# EAGLE design l6219-dev (EAGLE 5.12)
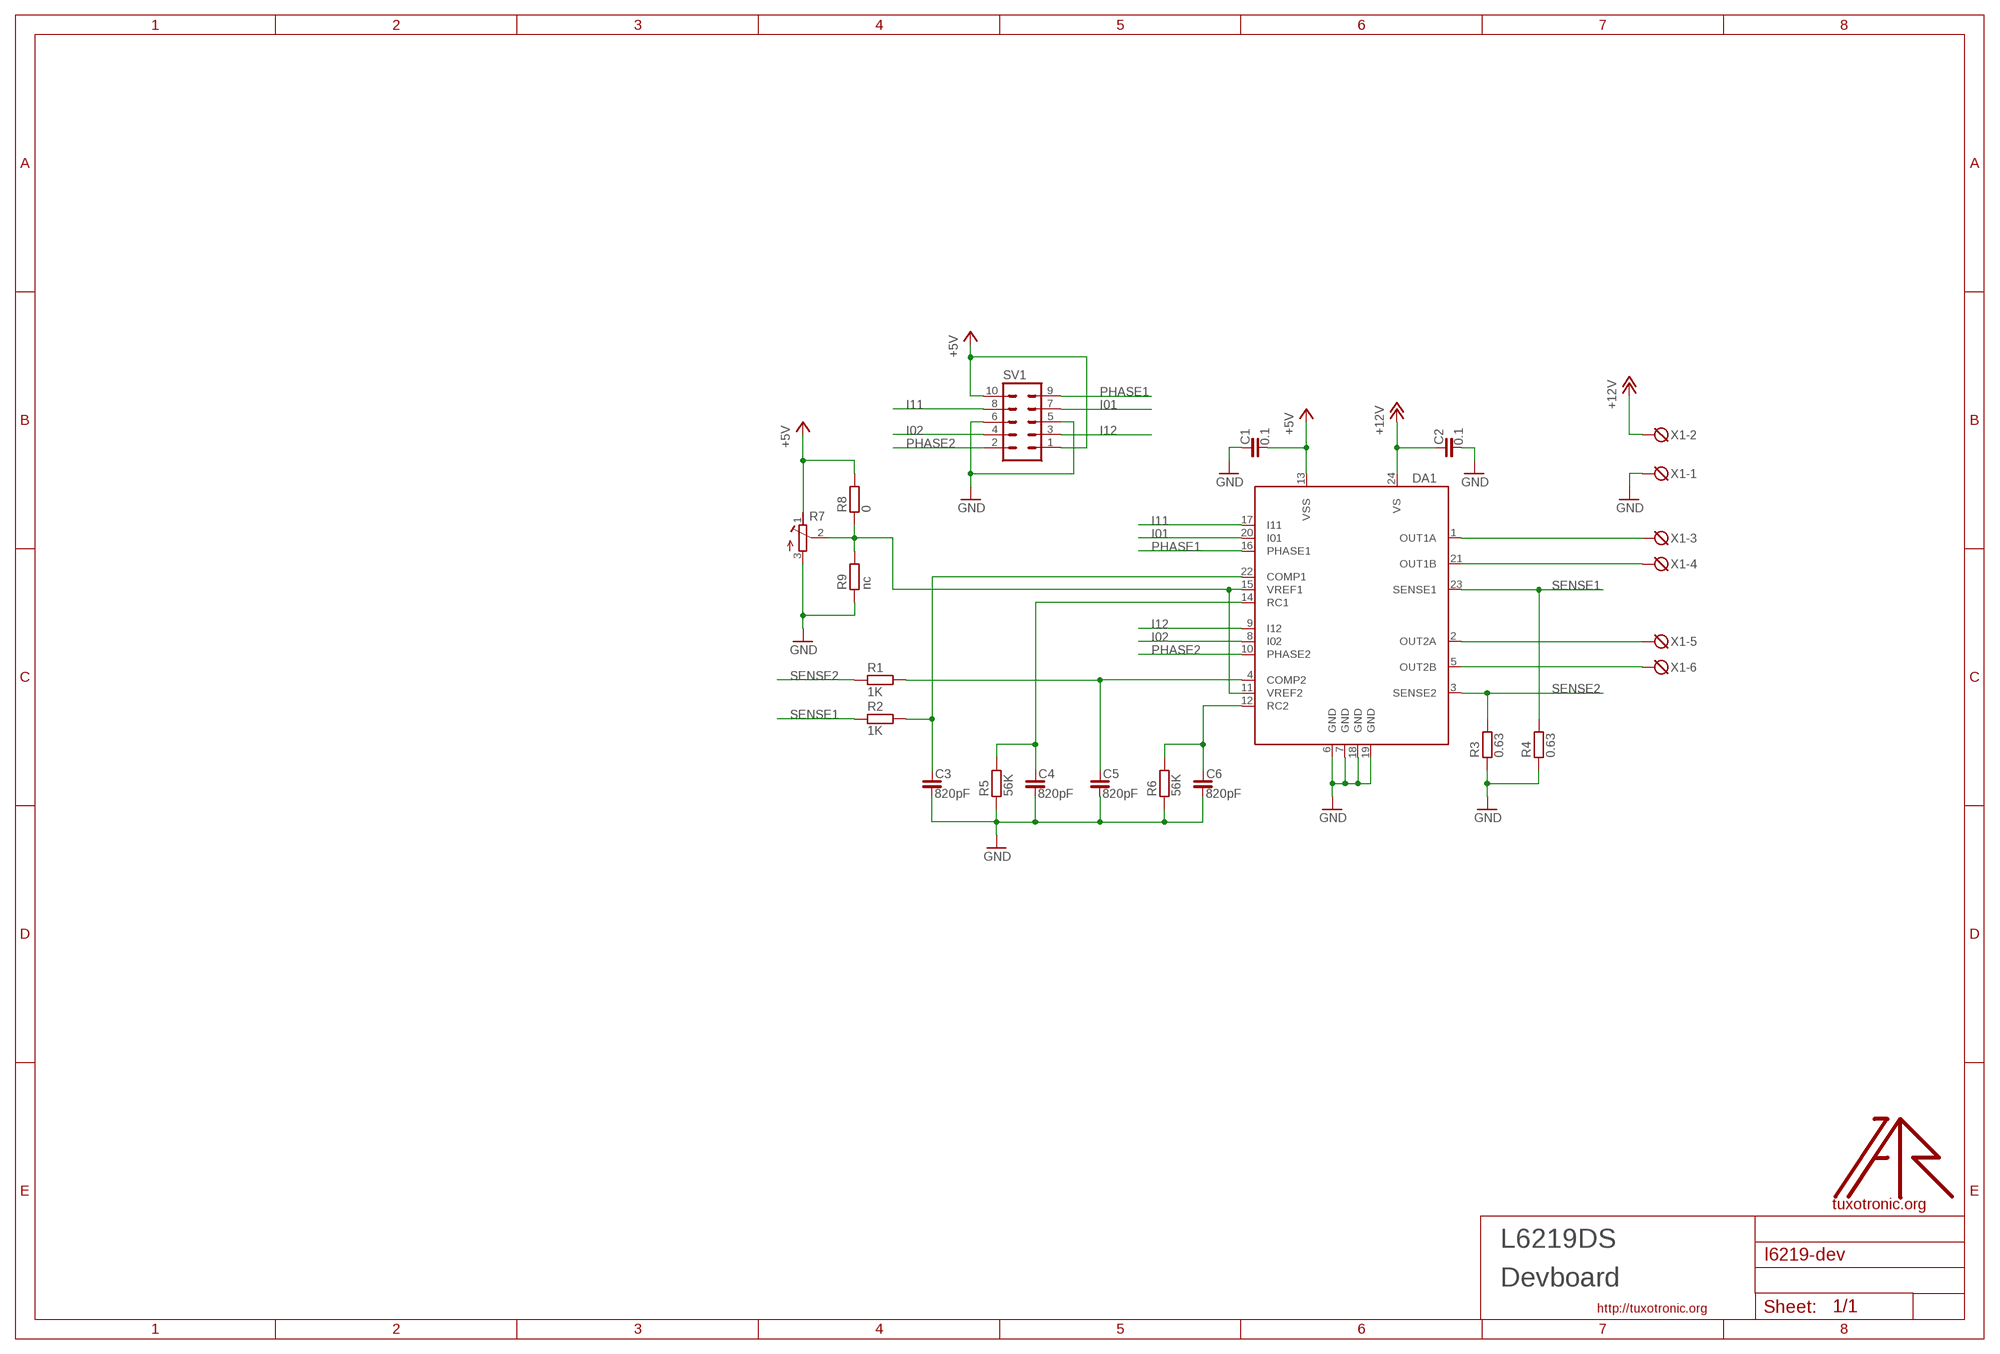
[diagram p0: schematic, sheet 1]

## Parts
C1  0.1  C_0805  [C0805]
C2  0.1  C_0805  [C0805]
C3  820pF  C_0805  [C0805]
C4  820pF  C_0805  [C0805]
C5  820pF  C_0805  [C0805]
C6  820pF  C_0805  [C0805]
DA1  L6219DS  [SO24W]
R1  1K  R_0805  [R0805]
R2  1K  R_0805  [R0805]
R3  0.63  R_1210  [R1210]
R4  0.63  R_1210  [R1210]
R5  56K  R_0805  [R0805]
R6  56K  R_0805  [R0805]
R7  RTRIM  [RTRIM-3362P]
R8  0  R_0805  [R0805]
R9  nc  R_0805  [R0805]
SV1  ML10  [ML10]
U$  LOGO  [TT_LOGO]
X1  DG3XX-06-5.0  [DG306-5.0-06P]

## Nets
+5V: C1.2 DA1.13(VSS) R7.1(A) R8.2 SV1.1 SV1.10
+12V: C2.1 DA1.24(VS) X1.2
GND: C1.1 C2.2 C3.2 C4.2 C5.2 C6.2 DA1.6(GND) DA1.7(GND) DA1.18(GND) DA1.19(GND) R3.1 R4.1 R5.1 R6.1 R7.3(E) R9.1 SV1.5 SV1.6 X1.1
I01: DA1.20(I01) SV1.7
I02: DA1.8(I02) SV1.4
I11: DA1.17(I11) SV1.8
I12: DA1.9(I12) SV1.3
N$1: C6.1 DA1.12(RC2) R6.2
N$2: C4.1 DA1.14(RC1) R5.2
N$4: C5.1 DA1.4(COMP2) R1.2
N$5: C3.1 DA1.22(COMP1) R2.2
N$6: DA1.2(OUT2A) X1.5
N$7: DA1.5(OUT2B) X1.6
N$8: DA1.1(OUT1A) X1.3
N$9: DA1.21(OUT1B) X1.4
PHASE1: DA1.16(PHASE1) SV1.9
PHASE2: DA1.10(PHASE2) SV1.2
SENSE1: DA1.23(SENSE1) R2.1 R4.2
SENSE2: DA1.3(SENSE2) R1.1 R3.2
VREF: DA1.11(VREF2) DA1.15(VREF1) R7.2(S) R8.1 R9.2

## Notes on the sheet
- L6219DS
- Devboard

## Library data of the parts
C1-C6 = rc-master-smd:C_: NON-POLARIZED CAP
DA1 = h-bridge:L6219: Stepper motor driver
R1-R6 R8 R9 = rc-master-smd:R_: RESISTOR
R7 = lcd-char:RTRIM
SV1 = con-ml:ML10: HARTING
U$ = logo:LOGO
X1 = degson:DG3XX-06: DG350-3.5-06P DG306-5.0-06P

## Board
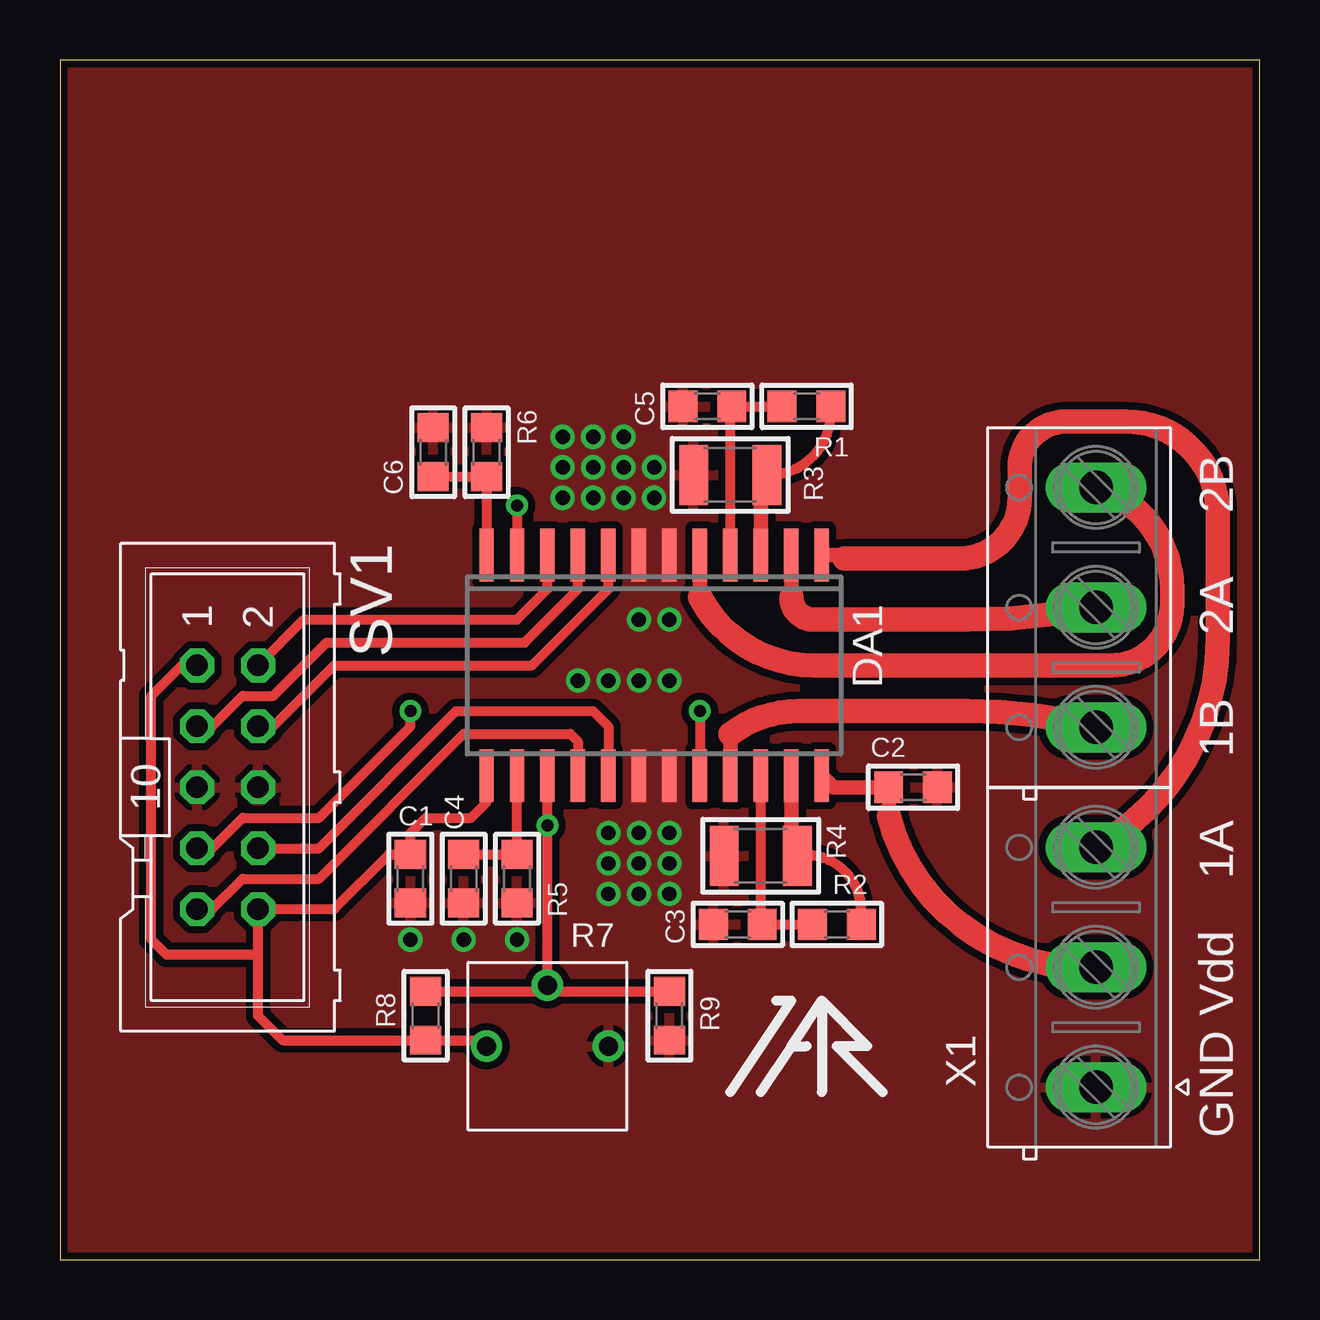
[diagram p1: board, top side]
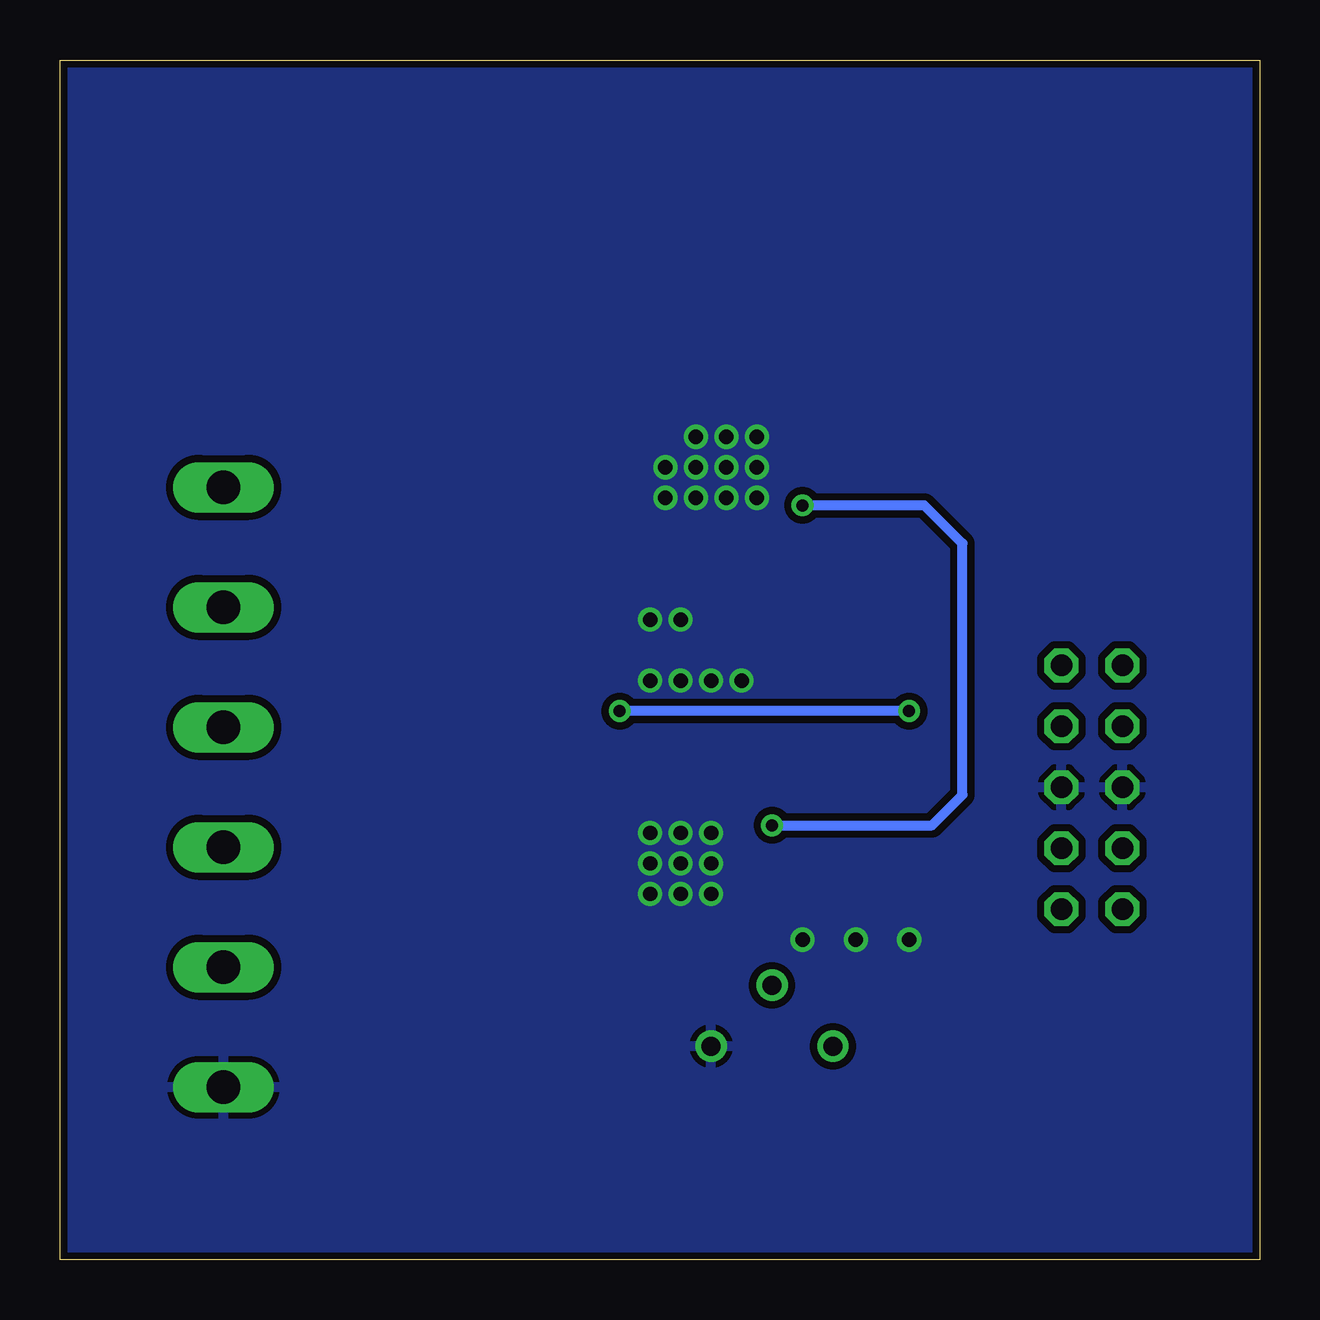
[diagram p2: board, bottom side, seen from below]

Size 50 x 50 mm. Coordinates in mm from the lower left corner, seen from the top.
Outline: 0,0 50,0 50,50 0,50 0,0
Copper layers (1*16): Top 0.035mm / dielectric 1.5mm / Bottom 0.035mm
Design rules "resonit-speed-18mkm_new": minimum track width 10mil, minimum drill 0.4mm, track to track 0.16mm, track to pad 0.16mm, pad to pad 0.16mm, via to via 0.16mm, smd to smd 0.16mm, copper to edge 0.3mm, drill to drill 8mil, minimum pad ring 10mil, minimum via ring 8mil, stop-mask expansion 4mil, vias tented up to drill 0.6mm, thermal gap 10mil

### Footprints (pad centres in the part's own frame; a part is rotated, then mirrored left to right if it is on the bottom)
C0805 = smd 1.2 x 1.3: 1 -1.016,0; 2 1.016,0
SO24W = smd 0.6 x 2.2: 1 -6.985,-4.6; 2 -5.715,-4.6; 3 -4.445,-4.6; 4 -3.175,-4.6; 5 -1.905,-4.6; 6 -0.635,-4.6; 7 0.635,-4.6; 8 1.905,-4.6; 9 3.175,-4.6; 10 4.445,-4.6; 11 5.715,-4.6; 12 6.985,-4.6; 13 6.985,4.6; 14 5.715,4.6; 15 4.445,4.6; 16 3.175,4.6; 17 1.905,4.6; 18 0.635,4.6; 19 -0.635,4.6; 20 -1.905,4.6; 21 -3.175,4.6; 22 -4.445,4.6; 23 -5.715,4.6; 24 -6.985,4.6
R0805 = smd 1.2 x 1.3: 1 -1.016,0; 2 1.016,0
R1210 = smd 1.2 x 2.5: 1 -1.524,0; 2 1.524,0
RTRIM-3362P = drill 0.8 round: 1 -2.54,0; 2 0,2.54; 3 2.54,0
ML10 = drill 0.9 octagon: 1 -5.08,-1.27; 2 -5.08,1.27; 3 -2.54,-1.27; 4 -2.54,1.27; 5 0,-1.27; 6 0,1.27; 7 2.54,-1.27; 8 2.54,1.27; 9 5.08,-1.27; 10 5.08,1.27
DG306-5.0-06P = drill 1.4 long: 1 -12.5,0; 2 -7.5,0; 3 -2.5,0; 4 2.5,0; 5 7.5,0; 6 12.5,0

### Placement (x,y rotation side)
C1  14.61,15.88 90 top
C2  35.56,19.68 0 top
C3  28.26,13.97 180 top
C4  16.83,15.88 270 top
C5  26.99,35.56 180 top
C6  15.56,33.66 90 top
DA1  24.77,24.77 180 top
R1  31.11,35.56 180 top
R2  32.38,13.97 180 top
R3  27.94,32.7 0 top
R4  29.21,16.83 0 top
R5  19.05,15.88 90 top
R6  17.78,33.66 270 top
R7  20.32,8.89 0 top
R8  15.24,10.16 270 top
R9  25.4,10.16 90 top
SV1  6.99,19.68 270 top
U$  31.75,9.53 0 top
X1  43.18,19.68 90 top

### Tracks (layer width: path | path; a pad name or v marks a point on that pad's centre or on a via)
+5V
  Top 0.406: SV1.1 5.08,24.77 3.81,23.5 3.81,13.34 4.45,12.7 8.26,12.7 | 8.26,12.7 SV1.10 11.43,14.61 13.72,16.89 C1.2 14.61,17.78 15.24,18.41 17.14,18.41 17.78,19.05 DA1.13 | R7.1 17.53,9.14 R8.2 9.27,9.14 8.26,10.16 8.26,12.7
+12V
  Top 0.61: DA1.24 32.23,19.68 C2.1 34.54,18.48
  Top 1.016: X1.2 42.74,12.19 arc-75 34.54,18.48
GND  (via drill 0.6)
  other vias: 19.05,13.34 16.83,13.34 14.61,13.34 25.4,17.78 24.13,17.78 22.86,17.78 25.4,16.51 24.13,16.51 22.86,16.51 25.4,15.24 24.13,15.24 22.86,15.24 25.4,24.13 24.13,24.13 25.4,26.67 24.13,26.67 24.77,31.75 23.5,31.75 22.23,31.75 22.23,33.02 23.5,33.02 24.77,33.02 23.5,34.29 22.23,34.29 20.95,34.29 20.95,33.02 20.95,31.75 22.86,24.13 21.59,24.13
  pour Top (isolate 0.305, rank 5): -0.64,50.8 50.8,50.8 50.8,-0.64 -0.64,-0.64
  pour Bottom (isolate 0.305, rank 5): -1.27,51.44 51.44,51.44 51.44,-1.27 -1.27,-1.27
I01  (via drill 0.5)
  Top 0.406: v26.67,22.86 DA1.20 | v14.61,22.86 14.61,22.23 10.79,18.41 7.62,18.41 6.35,17.14 SV1.7
  Bottom 0.406: v14.61,22.86 v26.67,22.86
I02
  Top 0.406: SV1.4 8.89,22.23 11.43,24.77 19.68,24.77 22.86,27.94 DA1.8
I11
  Top 0.406: DA1.17 22.86,22.23 22.23,22.86 16.51,22.86 10.79,17.14 SV1.8
I12
  Top 0.406: SV1.3 6.35,22.23 7.62,23.5 8.89,23.5 11.11,25.72 19.37,25.72 21.59,27.94 DA1.9
N$1
  Top 0.406: DA1.12 R6.2 C6.1
N$2
  Top 0.406: C4.1 R5.2 DA1.14
N$4
  Top 0.406: DA1.4 27.94,35.5 C5.1 R1.2
N$5
  Top 0.406: C3.1 29.21,14.03 | C3.1 29.53,13.97 | 29.53,13.97 R2.2 | DA1.22 29.21,14.29 29.53,13.97 | 29.53,13.97 29.53,14.22 C3.1
N$6
  Top 0.61: 30.48,27.62 DA1.2
  Top 1.016: 30.48,27.62 arc90 31.43,26.67 37.82,26.67 arc11 X1.5
N$7
  Top 0.61: 26.67,27.62 DA1.5
  Top 1.016: 26.67,27.62 arc62 31.43,24.77 43.81,24.77 arc90 46.35,27.3 46.35,27.94 arc74 X1.6
N$8
  Top 0.61: DA1.1 32.55,29.36 32.7,29.21
  Top 1.016: 32.7,29.21 37.47,29.21 arc90 40.01,31.75 40.01,33.02 arc-90 41.91,34.92 44.45,34.92 arc-90 48.26,31.11 48.26,25.84 arc-61 X1.3
N$9
  Top 0.61: DA1.21 27.94,21.91
  Top 1.016: 27.94,21.91 arc-37 30.8,22.86 37.82,22.86 arc-14 X1.4
PHASE1
  Top 0.406: DA1.16 21.59,21.59 21.27,21.91 16.83,21.91 10.79,15.88 7.62,15.88 6.35,14.61 SV1.9
PHASE2
  Top 0.406: SV1.2 10.16,26.67 19.05,26.67 20.32,27.94 DA1.10
SENSE1
  Top 0.406: R2.1 33.4,14.54 arc99 R4.2
  Top 0.61: DA1.23 30.48,17.84 R4.2
SENSE2
  Top 0.406: R1.1 32.13,35.31 arc-91 R3.2
  Top 0.61: DA1.3 29.21,32.77 R3.2
VREF  (via drill 0.5)
  Top 0.406: DA1.15 v20.32,18.1 R7.2 | R8.1 20.07,11.18 R7.2 | R9.2 20.57,11.18 R7.2 | v19.05,31.43 DA1.11
  Bottom 0.406: v19.05,31.43 13.97,31.43 12.38,29.84 12.38,19.37 13.65,18.1 v20.32,18.1

### Text on the board
tPlace: 2B | 2A | 1B | 1A | Vdd | GND